# Altium project Zynq 7000 Demo.PrjPcb (part 7 of 9)

## Sheet [10] - ETHERNET.SchDoc: Z7010 B35, ADC, DAC
size B; Organization: Altium Limited; Address1: L3, 12a Rodborough Rd; Address2: Frenchs Forest; Address3: NSW; Address4: Australia 2086; DocumentNumber: 10; Revision: V1I1; SheetNumber: 10; SheetTotal: 16
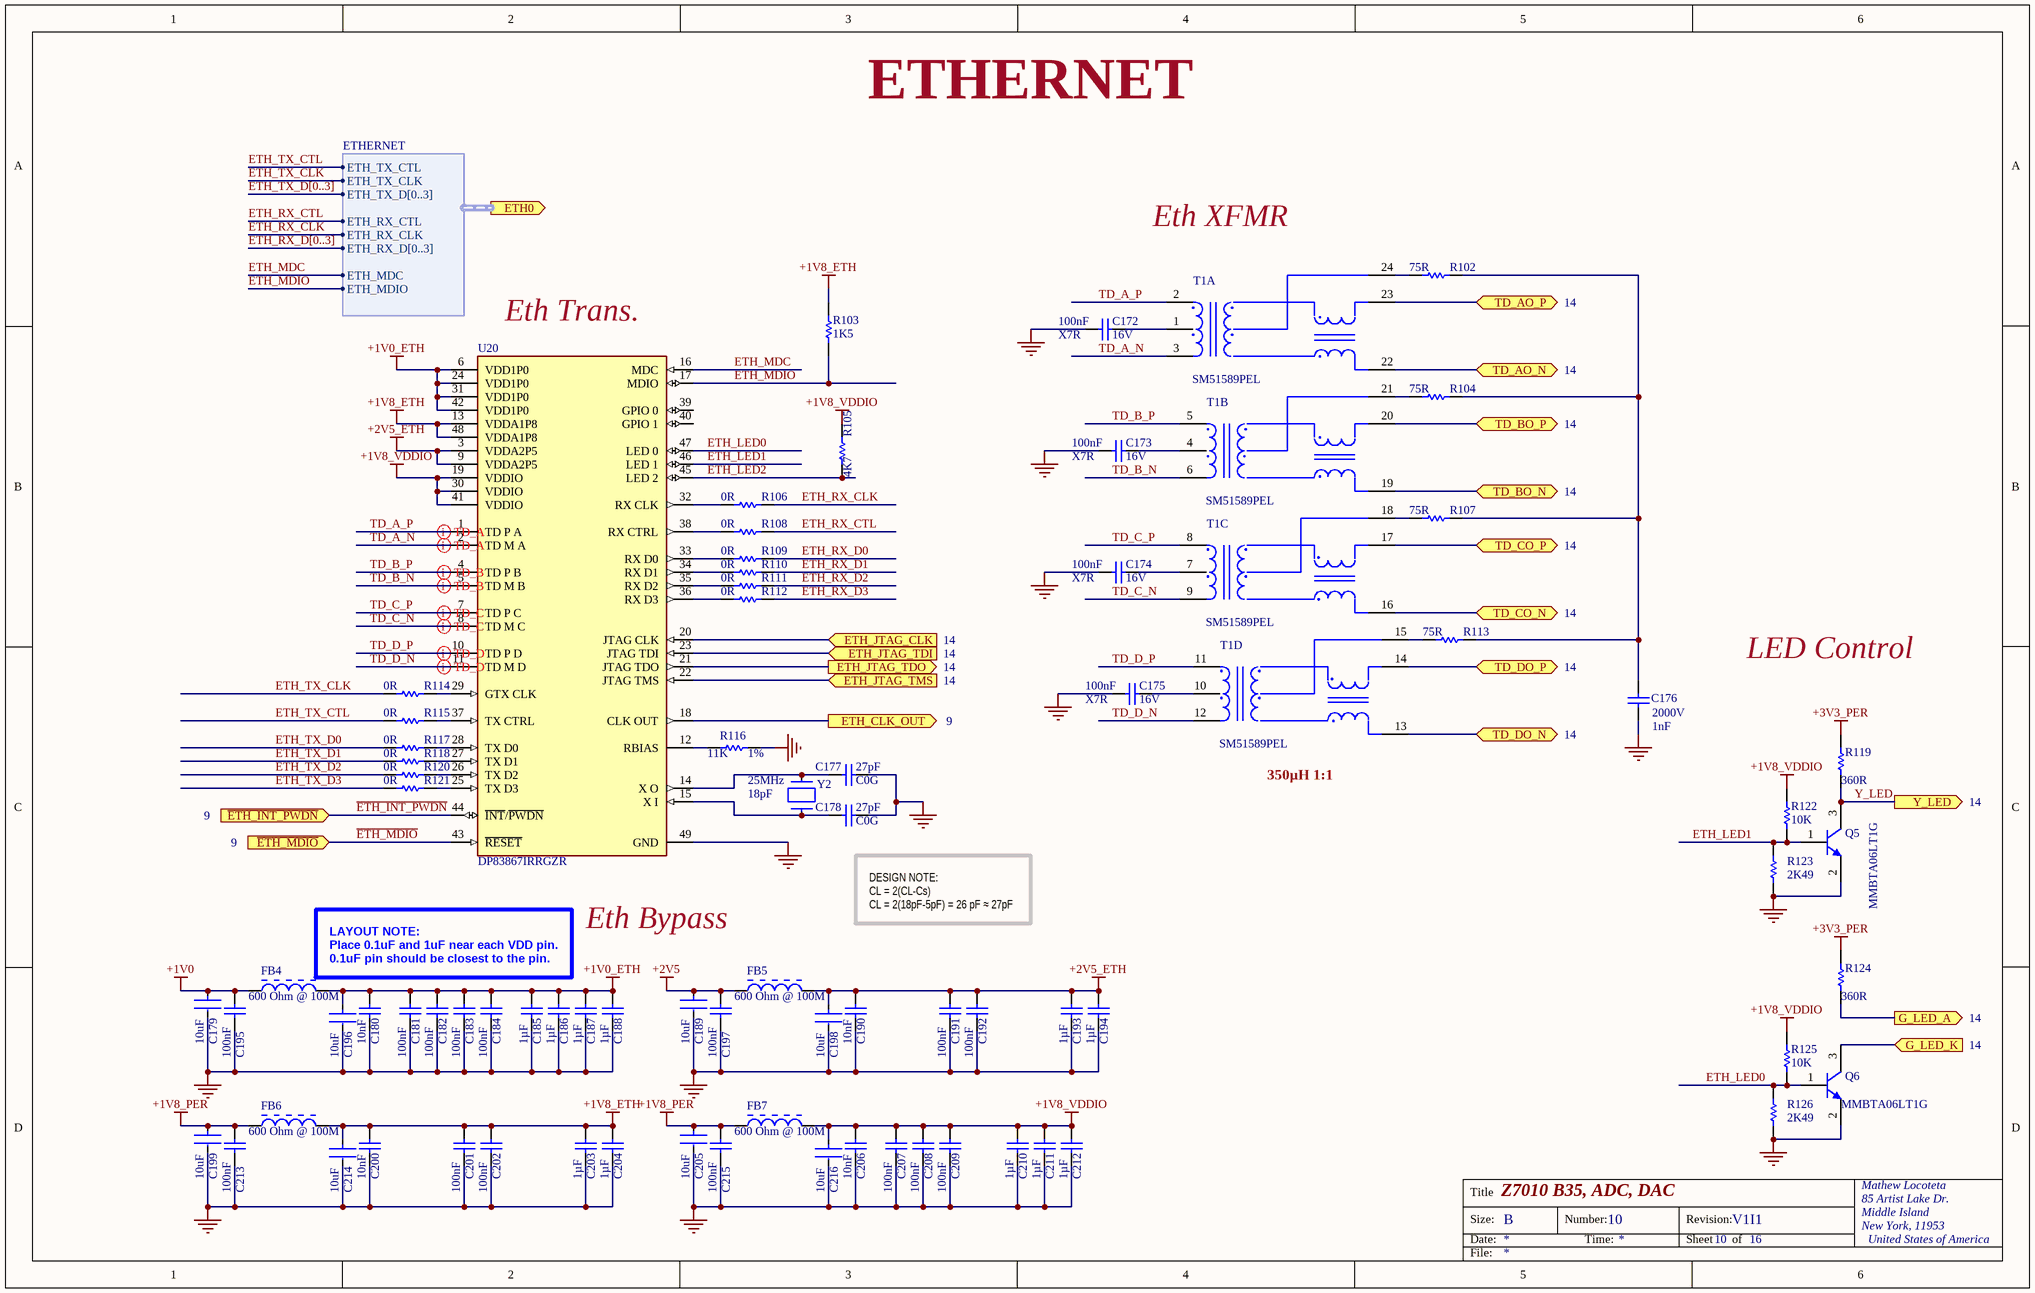
[diagram p9: [10] - ETHERNET.SchDoc]

### Parts
C172  Dielectric: X7R  Voltage Rating: 16V  Capacitance: 100nF  (hidden comment: 100nF 0402 16V)
C173  Dielectric: X7R  Voltage Rating: 16V  Capacitance: 100nF  (hidden comment: 100nF 0402 16V)
C174  Dielectric: X7R  Voltage Rating: 16V  Capacitance: 100nF  (hidden comment: 100nF 0402 16V)
C175  Dielectric: X7R  Voltage Rating: 16V  Capacitance: 100nF  (hidden comment: 100nF 0402 16V)
C176  Rated Voltage: 2000V  Capacitance: 1nF  [CAPC4620X180X75LL50T35]  (hidden comment: 1808GC102KAT1A)
C177  value 27pF  Dielecctric: C0G  [CAPC0402(1005)60_M]  (hidden comment: CAP 27pF 50V 0402(1005))
C178  value 27pF  Dielecctric: C0G  [CAPC0402(1005)60_M]  (hidden comment: CAP 27pF 50V 0402(1005))
C179  Capacitance: 10uF  [FP-CL07-IPC_C]  (hidden comment: CL05A106MP8NUB8)
C180  Capacitance: 10nF  (hidden comment: 10nF 16V 0402 X7R)
C181  Capacitance: 100nF  (hidden comment: 100nF 0402 16V)
C182  Capacitance: 100nF  (hidden comment: 100nF 0402 16V)
C183  Capacitance: 100nF  (hidden comment: 100nF 0402 16V)
C184  Capacitance: 100nF  (hidden comment: 100nF 0402 16V)
C185  value 1µF  [CAPC1005X60X30LL05T10]  (hidden comment: C0402C105K8PAC7867)
C186  value 1µF  [CAPC1005X60X30LL05T10]  (hidden comment: C0402C105K8PAC7867)
C187  value 1µF  [CAPC1005X60X30LL05T10]  (hidden comment: C0402C105K8PAC7867)
C188  value 1µF  [CAPC1005X60X30LL05T10]  (hidden comment: C0402C105K8PAC7867)
C189  Capacitance: 10uF  [FP-CL07-IPC_C]  (hidden comment: CL05A106MP8NUB8)
C190  Capacitance: 10nF  (hidden comment: 10nF 16V 0402 X7R)
C191  Capacitance: 100nF  (hidden comment: 100nF 0402 16V)
C192  Capacitance: 100nF  (hidden comment: 100nF 0402 16V)
C193  value 1µF  [CAPC1005X60X30LL05T10]  (hidden comment: C0402C105K8PAC7867)
C194  value 1µF  [CAPC1005X60X30LL05T10]  (hidden comment: C0402C105K8PAC7867)
C195  Capacitance: 100nF  (hidden comment: 100nF 0402 16V)
C196  Capacitance: 10uF  [FP-CL07-IPC_C]  (hidden comment: CL05A106MP8NUB8)
C197  Capacitance: 100nF  (hidden comment: 100nF 0402 16V)
C198  Capacitance: 10uF  [FP-CL07-IPC_C]  (hidden comment: CL05A106MP8NUB8)
C199  Capacitance: 10uF  [FP-CL07-IPC_C]  (hidden comment: CL05A106MP8NUB8)
C200  Capacitance: 10nF  (hidden comment: 10nF 16V 0402 X7R)
C201  Capacitance: 100nF  (hidden comment: 100nF 0402 16V)
C202  Capacitance: 100nF  (hidden comment: 100nF 0402 16V)
C203  value 1µF  [CAPC1005X60X30LL05T10]  (hidden comment: C0402C105K8PAC7867)
C204  value 1µF  [CAPC1005X60X30LL05T10]  (hidden comment: C0402C105K8PAC7867)
C205  Capacitance: 10uF  [FP-CL07-IPC_C]  (hidden comment: CL05A106MP8NUB8)
C206  Capacitance: 10nF  (hidden comment: 10nF 16V 0402 X7R)
C207  Capacitance: 100nF  (hidden comment: 100nF 0402 16V)
C208  Capacitance: 100nF  (hidden comment: 100nF 0402 16V)
C209  Capacitance: 100nF  (hidden comment: 100nF 0402 16V)
C210  value 1µF  [CAPC1005X60X30LL05T10]  (hidden comment: C0402C105K8PAC7867)
C211  value 1µF  [CAPC1005X60X30LL05T10]  (hidden comment: C0402C105K8PAC7867)
C212  value 1µF  [CAPC1005X60X30LL05T10]  (hidden comment: C0402C105K8PAC7867)
C213  Capacitance: 100nF  (hidden comment: 100nF 0402 16V)
C214  Capacitance: 10uF  [FP-CL07-IPC_C]  (hidden comment: CL05A106MP8NUB8)
C215  Capacitance: 100nF  (hidden comment: 100nF 0402 16V)
C216  Capacitance: 10uF  [FP-CL07-IPC_C]  (hidden comment: CL05A106MP8NUB8)
FB4  Impedance (at 100 MHz): 600 Ohm @ 100M  [MURA-BLM18-RF-H4-CHIP-2_V]  (hidden comment: BLM18HE601SN1D)
FB5  Impedance (at 100 MHz): 600 Ohm @ 100M  [MURA-BLM18-RF-H4-CHIP-2_V]  (hidden comment: BLM18HE601SN1D)
FB6  Impedance (at 100 MHz): 600 Ohm @ 100M  [MURA-BLM18-RF-H4-CHIP-2_V]  (hidden comment: BLM18HE601SN1D)
FB7  Impedance (at 100 MHz): 600 Ohm @ 100M  [MURA-BLM18-RF-H4-CHIP-2_V]  (hidden comment: BLM18HE601SN1D)
Q5  MMBTA06LT1G  [ONSC-SOT-23-3-318-08_V]
Q6  MMBTA06LT1G  [ONSC-SOT-23-3-318-08_V]
R102  Resistance: 75R  (hidden comment: 75R 0805)
R103  value 1K5  [RESC1005X40X25NL05T05]  (hidden comment: CRCW04021K50FKED)
R104  Resistance: 75R  (hidden comment: 75R 0805)
R105  Resistance: 4K7  (hidden comment: 4K7 0402 1%)
R106  value 0R  [RESC1005X40X25ML05T10]  (hidden comment: CRCW04020000Z0EDHP)
R107  Resistance: 75R  (hidden comment: 75R 0805)
R108  value 0R  [RESC1005X40X25ML05T10]  (hidden comment: CRCW04020000Z0EDHP)
R109  value 0R  [RESC1005X40X25ML05T10]  (hidden comment: CRCW04020000Z0EDHP)
R110  value 0R  [RESC1005X40X25ML05T10]  (hidden comment: CRCW04020000Z0EDHP)
R111  value 0R  [RESC1005X40X25ML05T10]  (hidden comment: CRCW04020000Z0EDHP)
R112  value 0R  [RESC1005X40X25ML05T10]  (hidden comment: CRCW04020000Z0EDHP)
R113  Resistance: 75R  (hidden comment: 75R 0805)
R114  value 0R  [RESC1005X40X25ML05T10]  (hidden comment: CRCW04020000Z0EDHP)
R115  value 0R  [RESC1005X40X25ML05T10]  (hidden comment: CRCW04020000Z0EDHP)
R116  value 11K  Tolerance: 1%  [RESC1005X40X25NL05T05]  (hidden comment: CRCW040211K0FKED)
R117  value 0R  [RESC1005X40X25ML05T10]  (hidden comment: CRCW04020000Z0EDHP)
R118  value 0R  [RESC1005X40X25ML05T10]  (hidden comment: CRCW04020000Z0EDHP)
R119  value 360R  [RESC1005X40X25NL05T05]  (hidden comment: CRCW0402360RFKED)
R120  value 0R  [RESC1005X40X25ML05T10]  (hidden comment: CRCW04020000Z0EDHP)
R121  value 0R  [RESC1005X40X25ML05T10]  (hidden comment: CRCW04020000Z0EDHP)
R122  value 10K  [RESC1005X40X25ML05T10]  (hidden comment: CRCW040210K0FKEDHP)
R123  value 2K49  [RESC1005X40X25ML05T05]  (hidden comment: CRCW04022K49FKTD)
R124  value 360R  [RESC1005X40X25NL05T05]  (hidden comment: CRCW0402360RFKED)
R125  value 10K  [RESC1005X40X25ML05T10]  (hidden comment: CRCW040210K0FKEDHP)
R126  value 2K49  [RESC1005X40X25ML05T05]  (hidden comment: CRCW04022K49FKTD)
T1  SM51589PEL  [FP-SM51589PEL-MFG]  (parts A,B,C,D of 4)
U20  DP83867IRRGZR  [FP-RGZ0048B-MFG]
Y2  Load Capacitance: 18pF  Frequency: 25MHz  [FP-7A-MFG]  (hidden comment: 7A-25.000MAAJ-T)

### Ports
ETH0 (out, harness ETHERNET), ETH_CLK_OUT (out), ETH_JTAG_CLK (in), ETH_JTAG_TDI (in), ETH_JTAG_TDO (out), ETH_JTAG_TMS (in), G_LED_A (out), G_LED_K (in), TD_AO_N (bidir), TD_AO_P (bidir), TD_BO_N (bidir), TD_BO_P (bidir), TD_CO_N (bidir), TD_CO_P (bidir), TD_DO_N (bidir), TD_DO_P (bidir), Y_LED (out), ~{ETH_INT_PWDN} (in), ~{ETH_MDIO} (in)

### Harnesses
ETHERNET: ETH_TX_D[0..3], ETH_RX_D[0..3], ETH_RX_CLK, ETH_TX_CLK, ETH_TX_CTL, ETH_RX_CTL, ETH_MDC, ETH_MDIO

### Nets
+1V0: C179.1 C195.2 FB4.1
+1V0_ETH: C180.2 C181.2 C182.2 C183.2 C184.2 C185.2 C186.2 C187.2 C188.2 C196.1 FB4.2 U20.6(VDD1P0) U20.24(VDD1P0) U20.31(VDD1P0) U20.42(VDD1P0)
+1V8_ETH: C200.2 C201.2 C202.2 C203.2 C204.2 C214.1 FB6.2 R103.2 U20.13(VDDA1P8) U20.48(VDDA1P8)
+1V8_PER: C199.1 C205.1 C213.2 C215.2 FB6.1 FB7.1
+1V8_VDDIO: C206.2 C207.2 C208.2 C209.2 C210.2 C211.2 C212.2 C216.1 FB7.2 R105.2 R122.2 R125.2 U20.19(VDDIO) U20.30(VDDIO) U20.41(VDDIO)
+2V5: C189.1 C197.2 FB5.1
+2V5_ETH: C190.2 C191.2 C192.2 C193.2 C194.2 C198.1 FB5.2 U20.3(VDDA2P5) U20.9(VDDA2P5)
+3V3_PER: R119.2 R124.2
GND: C172.2 C173.2 C174.2 C175.2 C176.1 C177.2 C178.2 C179.2 C180.1 C181.1 C182.1 C183.1 C184.1 C185.1 C186.1 C187.1 C188.1 C189.2 C190.1 C191.1 C192.1 C193.1 C194.1 C195.1 C196.2 C197.1 C198.2 C199.2 C200.1 C201.1 C202.1 C203.1 C204.1 C205.2 C206.1 C207.1 C208.1 C209.1 C210.1 C211.1 C212.1 C213.1 C214.2 C215.1 C216.2 Q5.2(E) Q6.2(E) R116.1 R123.1 R126.1 U20.49(GND)
~{ETH_INT_PWDN}: U20.44(~{INT}/~{PWDN}) ; port ~{ETH_INT_PWDN}
~{ETH_MDIO}: U20.43(~{RESET}) ; port ~{ETH_MDIO}
ETH_CLK_OUT: U20.18(CLK_OUT) ; port ETH_CLK_OUT
ETH_JTAG_CLK: U20.20(JTAG_CLK) ; port ETH_JTAG_CLK
ETH_JTAG_TDI: U20.23(JTAG_TDI) ; port ETH_JTAG_TDI
ETH_JTAG_TMS: U20.22(JTAG_TMS) ; port ETH_JTAG_TMS
ETH_LED0: Q6.1(B) R125.1 R126.2 U20.47(LED_0)
ETH_LED1: Q5.1(B) R122.1 R123.2 U20.46(LED_1)
ETH_LED2: R105.1 U20.45(LED_2)
ETH_MDC: U20.16(MDC) ; port ETH0.ETH_MDC
ETH_MDIO: R103.1 U20.17(MDIO) ; port ETH0.ETH_MDIO
ETH_RX_CLK: R106.2 ; port ETH0.ETH_RX_CLK
ETH_RX_CTL: R108.2 ; port ETH0.ETH_RX_CTL
ETH_RX_D0: R109.2
ETH_RX_D1: R110.2
ETH_RX_D2: R111.2
ETH_RX_D3: R112.2
ETH_TX_CLK: R114.1 ; port ETH0.ETH_TX_CLK
ETH_TX_CTL: R115.1 ; port ETH0.ETH_TX_CTL
ETH_TX_D0: R117.1
ETH_TX_D1: R118.1
ETH_TX_D2: R120.1
ETH_TX_D3: R121.1
G_LED_A: R124.1 ; port G_LED_A
G_LED_K: Q6.3(C) ; port G_LED_K
JTAG_TDI: U20.21(JTAG_TDO) ; port ETH_JTAG_TDO
TD_A_N: T1.3(MX1-) U20.2(TD_M_A)
TD_A_P: T1.2(MX1+) U20.1(TD_P_A)
TD_AO_N: T1.22(TD1-) ; port TD_AO_N
TD_AO_P: T1.23(TD1+) ; port TD_AO_P
TD_B_N: T1.6(MX2-) U20.5(TD_M_B)
TD_B_P: T1.5(MX2+) U20.4(TD_P_B)
TD_BO_N: T1.19(TD2-) ; port TD_BO_N
TD_BO_P: T1.20(TD2+) ; port TD_BO_P
TD_C_N: T1.9(MX3-) U20.8(TD_M_C)
TD_C_P: T1.8(MX3+) U20.7(TD_P_C)
TD_CO_N: T1.16(TD3-) ; port TD_CO_N
TD_CO_P: T1.17(TD3+) ; port TD_CO_P
TD_D_N: T1.12(MX4-) U20.11(TD_M_D)
TD_D_P: T1.11(MX4+) U20.10(TD_P_D)
TD_DO_N: T1.13(TD4-) ; port TD_DO_N
TD_DO_P: T1.14(TD4+) ; port TD_DO_P
Y_LED: Q5.3(C) R119.1 ; port Y_LED
NetC172_1: C172.1 T1.1(MCT1)
NetC173_1: C173.1 T1.4(MCT2)
NetC174_1: C174.1 T1.7(MCT3)
NetC175_1: C175.1 T1.10(MCT4)
NetC176_2: C176.2 R102.2 R104.2 R107.2 R113.2
NetC177_1: C177.1 U20.14(X_O) Y2.2
NetC178_1: C178.1 U20.15(X_I) Y2.1
NetR102_1: R102.1 T1.24(TCT1)
NetR104_1: R104.1 T1.21(TCT2)
NetR106_1: R106.1 U20.32(RX_CLK)
NetR107_1: R107.1 T1.18(TCT3)
NetR108_1: R108.1 U20.38(RX_CTRL)
NetR109_1: R109.1 U20.33(RX_D0)
NetR110_1: R110.1 U20.34(RX_D1)
NetR111_1: R111.1 U20.35(RX_D2)
NetR112_1: R112.1 U20.36(RX_D3)
NetR113_1: R113.1 T1.15(TCT4)
NetR114_2: R114.2 U20.29(GTX_CLK)
NetR115_2: R115.2 U20.37(TX_CTRL)
NetR116_2: R116.2 U20.12(RBIAS)
NetR117_2: R117.2 U20.28(TX_D0)
NetR118_2: R118.2 U20.27(TX_D1)
NetR120_2: R120.2 U20.26(TX_D2)
NetR121_2: R121.2 U20.25(TX_D3)

Not connected (* = marked no-connect by the designer): U20 39(GPIO_0) 40(GPIO_1)

### Buses and harness runs
bus ETH_RX_D[0..3]
bus ETH_TX_D[0..3]

### Layout directives
differential pair: TD_A_N, TD_A_P, TD_B_N, TD_B_P, TD_C_N, TD_C_P, TD_D_N, TD_D_P

### Notes on the sheet
- ETHERNET
- (near T1) Eth XFMR
- 14
- (near U20) Eth Trans.
- LED Control
- 9
- (near T1) 350µH 1:1
- Eth Bypass
- DESIGN NOTE:
  CL = 2(CL-Cs)
  CL = 2(18pF-5pF) = 26 pF ≈ 27pF
- LAYOUT NOTE:
  Place 0.1uF and 1uF near each VDD pin. 0.1uF pin should be closest to the pin.
- Title
- Size:
- Date:
- B
- Number:
- Time:
- Revision:
- Sheet
- of
- Mathew Locoteta
- 85 Artist Lake Dr.
- Middle Island
- New York, 11953
- United States of America
- File:

### Library data of the parts
C172-C175 C181-C184 C191 C192 C195 C197 C201 C202 C207-C209 C213 C215 = C0402C104J4RACTU: as C159-C171 on sheet [9] - Z7010 B35, ADC, DAC; Supplier 1: Digi-Key; Manufacturer: KEMET; Manufacturer Part Number: C0402C104J4RACTU; RoHS: Yes; Category: Ceramic Capacitors; Stock 1: 106350; Pricing 1: 1=0.48000, 10=0.33900, 50=0.25620, 100=0.22310, 500=0.16528, 1000=0.14049, 2500=0.13223, 5000=0.12396 (USD); Mount: Surface Mount,PCB; Case/Package: 0402; Case Code (Metric): 1005; Case Code (Imperial): 0402; Dielectric Material: Ceramic; Contact Plating: Tin,Matte; Min Operating Temperature: -55°C; Max Operating Temperature: 125°C; Tolerance: 5%; Packaging: Tape and Reel; Package Quantity: 1; Termination: SMD/SMT; Voltage: 16V; Length: 1mm; Height: 0.5mm; Width: 0.02inch; Thickness: 0.022inch; Depth: 0.5mm; Radiation Hardening: No; REACH SVHC: No SVHC; ComponentLink1URL: https://datasheet.ciiva.com/5415/kem-c1002-x7r-smd-5415819.pdf?src-supplier=Mouser; ComponentLink1Description: https://datasheet.ciiva.com/5415/kem-c1002-x7r-smd-5415819.pdf?src-supplier=Mouser; ComponentLink2URL: https://datasheet.ciiva.com/46424/1851736-46424159.pdf?src-supplier=Element14; ComponentLink2Description: https://datasheet.ciiva.com/46424/1851736-46424159.pdf?src-supplier=Element14; Supplier Part Number 1: 399-7761-1-ND; Voltage Rating (DC): 16V
  C181-C184 C191 C192 C195 C197 C201 C202 C207-C209 C213 C215: Dielectric: X7R; Voltage Rating: 16V
C176 = CMP-2000-05503-1: Chip Capacitor, 1000 pF, +/- 10%, 2000 V, -55 to 125 degC, 1808 (4520 Metric), RoHS, Tape and Reel; Manufacturer: AVX; Dielectric: X7R; Package Reference: 1808; Datasheet Version: 06/2016; Package Description: 2-Pin Surface Mount Device, Body 4.6 x 2 mm; Case Size/Dimension: 1808; Mounting Technology: SurfaceMount; Datasheet URL: http://datasheets.avx.com/AVX-HV_MLCC.pdf; Tolerance (%): ±10%; Manufacturer URL: http://www.avx.com/
C177 C178 = CMP-1034-00963-1: CAP 27pF 50V ±5% 0402 (1005 Metric) Thickness 0.6mm SMD; Case-EIA: 0402; Case-Metric: 1005; Tolerance: Â±5%; Max Thickness: 0.6 mm; Rated Voltage: 50 V; Technology: SMT
C179 C189 C196 C198 C199 C205 C214 C216 = CMP-13271-002778-1: Cap Ceramic 10uF 10V X5R ±20% SMD 0402 +85°C Paper T/R; Length: 0.039inch; Mount: Surface Mount; Case Code (Imperial): 0402; Max Operating Temperature: 85°C; Voltage Rating: 10V; Min Operating Temperature: -55°C; Case/Package: 0402; Thickness: 0.035inch; Width: 0.02inch; Case Code (Metric): 1005; Packaging: Tape and Reel; Tolerance: 20%
C180 C190 C200 C206 = C0402C103J4RACTU: KEMET - C0402C103J4RACTU - SMD Multilayer Ceramic Capacitor, 10000 pF, 16 V, 0402 [1005 Metric], ± 5%, X7R, C Series KEMET; Dissipation Factor: 3.5%; Supplier 1: Digi-Key; Manufacturer: KEMET; Manufacturer Part Number: C0402C103J4RACTU; RoHS: Yes; Category: Ceramic Capacitors; Stock 1: 814650; Pricing 1: 1=0.53000, 10=0.37100, 50=0.25960, 100=0.22250, 500=0.16688, 1000=0.14093, 2500=0.13351, 5000=0.12609 (USD); Mount: Surface Mount,PCB; Case/Package: 0402; Number of Pins: 2; Case Code (Metric): 1005; Case Code (Imperial): 0402; Dielectric Material: Ceramic; Min Operating Temperature: -55°C; Max Operating Temperature: 125°C; Packaging: Tape and Reel; Tolerance: 5%; Package Quantity: 10000; Voltage Rating (DC): 16V; Termination: SMD/SMT; Voltage: 16V; Length: 1mm; Height: 0.5mm; Width: 0.02inch; Thickness: 0.022inch; Depth: 0.5mm; Radiation Hardening: No; REACH SVHC: No SVHC; ComponentLink1URL: https://datasheet.ciiva.com/46448/1851736-46448647.pdf?src-supplier=Element14; ComponentLink1Description: https://datasheet.ciiva.com/46448/1851736-46448647.pdf?src-supplier=Element14; ComponentLink2URL: https://datasheet.ciiva.com/14593/70095383-14593069.pdf?src-supplier=Allied+Electronics; ComponentLink2Description: https://datasheet.ciiva.com/14593/70095383-14593069.pdf?src-supplier=Allied+Electronics; ComponentLink3URL: https://datasheet.ciiva.com/7747/kem-c1002-x7r-smd-7747611.pdf?src-supplier=Element14; ComponentLink3Description: https://datasheet.ciiva.com/7747/kem-c1002-x7r-smd-7747611.pdf?src-supplier=Element14; ComponentLink4URL: https://datasheet.ciiva.com/14604/70095383-14604557.pdf?src-supplier=Allied+Electronics; ComponentLink4Description: https://datasheet.ciiva.com/14604/70095383-14604557.pdf?src-supplier=Allied+Electronics; ComponentLink5URL: https://datasheet.ciiva.com/28645/1851736-28645374.pdf?src-supplier=Element14; ComponentLink5Description: https://datasheet.ciiva.com/28645/1851736-28645374.pdf?src-supplier=Element14; Supplier Part Number 1: 399-1039-1-ND; Dielectric: X7R; Voltage Rating: 16V
C185-C188 C193 C194 C203 C204 C210-C212 = CMP-2008-02081-1: Manufacturer: Kemet; Part Number: C0402C105K8PAC7867
FB4-FB7 = CMP-0686-00374-2: Chip Ferrite Bead for GHz Band High-speed Signal Lines, 600 Ohm, 800 mA, -55 to 125 degC, 1.6 x 0.8 x 0.95 mm SMD, Tape and Reel; Manufacturer: Murata; DC Resistance: 0.25 Ohm Max.; Rated Current: 800 mA; ComponentLink1URL: http://www.murata.com/; Mounting Technology: Surface Mount; ComponentLink2URL: http://www.murata.com/products/catalog/pdf/c31e.pdf; ComponentLink1Description: Manufacturer URL; PackageDescription: 2-Pin Chip, Body 1.6 x 0.8 mm; ComponentLink3Description: Package Specification; Operating Temperature Range: -55 to 125 degC; ComponentLink3URL: http://www.murata.com/products/catalog/pdf/c31e.pdf; ComponentLink2Description: Datasheet; DatasheetVersion: 08/2013; PartNumber: BLM18HE601SN1D; Packing: Tape and Reel; PackageReference: BLM18_H950-2
Q5 Q6 = CMP-1048-00619-1: Driver Transistor, NPN Silicon, 3-Pin SOT-23, Pb-Free, Tape and Reel; Manufacturer: On Semiconductor; IC Continuous (A): 0.5; fT Min (MHz): 100; ComponentLink1URL: http://www.onsemi.com/; ComponentLink1Description: Manufacturer URL; ComponentLink2Description: Datasheet; ComponentLink3URL: http://www.onsemi.cn/pub_link/Collateral/318-08.PDF; Packing: Tape and Reel; PackageVersion: Rev. AP, 11/2009; PackageDescription: 3-Pin Small Outline Transistor, Body 2.92 x 1.3 mm, Pitch 0.95 mm; RoHS: TRUE; PartNumber: MMBTA06LT1G; ComponentLink2URL: http://www.onsemi.cn/pub_link/Collateral/MMBTA05LT1-D.PDF; DatasheetVersion: Rev. 8; PackageReference: SOT-23-3-318-08; Polarity: NPN; ComponentLink3Description: Package Specification; Mounting Technology: Surface Mount
R102 R104 R107 R113 = CRCW080575R0FKEA: VISHAY - CRCW080575R0FKEA - Chipwiderstand, Oberflächenmontage, Dickschicht, 0805 [Metrisch 2012], 75 ohm, Baureihe CRCW, 150 V; Tolerance: 1%; Temperature Coefficient: 100ppm/°C; Power Rating: 125mW; Voltage Rating: 150V; Supplier 1: Digi-Key; Manufacturer: Vishay; Manufacturer Part Number: CRCW080575R0FKEA; RoHS: Yes; Category: Chip SMD Resistors; Stock 1: 74647; Pricing 1: 1=0.10000, 10=0.05700, 100=0.02310, 1000=0.01039, 2500=0.00902 (USD); Case/Package: 0805; Contact Plating: Tin; Case Code (Metric): 2012; Weight: 0.000194oz; Min Operating Temperature: -55°C; Max Operating Temperature: 155°C; Resistor Type: Thick Film; Packaging: Tape and Reel; Package Quantity: 10; Number of Terminations: 2; Max Power Dissipation: 125mW; Features: Automotive AEC-Q200; Termination: SMD/SMT; Voltage Rating (DC): 150V; Length: 2mm; Width: 0.049inch; Height: 0.45mm; Depth: 1.25mm; Lead Free: Lead Free; Military Standard: Not; REACH SVHC: Unknown; ComponentLink1URL: https://datasheet.ciiva.com/11811/0900766b80d98b26-11811307.pdf?src-supplier=RSComponents; ComponentLink1Description: https://datasheet.ciiva.com/11811/0900766b80d98b26-11811307.pdf?src-supplier=RSComponents; ComponentLink2URL: https://datasheet.ciiva.com/2495/dcrcwe3-2495665.pdf?src-supplier=Digi-Key; ComponentLink2Description: https://datasheet.ciiva.com/2495/dcrcwe3-2495665.pdf?src-supplier=Digi-Key; ComponentLink3URL: https://datasheet.ciiva.com/7673/1697337-7673495.pdf?src-supplier=Element14; ComponentLink3Description: https://datasheet.ciiva.com/7673/1697337-7673495.pdf?src-supplier=Element14; ComponentLink4URL: https://datasheet.ciiva.com/26316/fld-crcw-e3-data-en-26316535.pdf?src-supplier=Distrelec; ComponentLink4Description: https://datasheet.ciiva.com/26316/fld-crcw-e3-data-en-26316535.pdf?src-supplier=Distrelec; ComponentLink5URL: https://datasheet.ciiva.com/2495/dcrcwe3-2495666.pdf?src-supplier=Digi-Key; ComponentLink5Description: https://datasheet.ciiva.com/2495/dcrcwe3-2495666.pdf?src-supplier=Digi-Key; ComponentLink6URL: https://datasheet.ciiva.com/7673/1697337-7673369.pdf?src-supplier=Element14; ComponentLink6Description: https://datasheet.ciiva.com/7673/1697337-7673369.pdf?src-supplier=Element14; ComponentLink7URL: https://datasheet.ciiva.com/16763/70201119-16763292.pdf?src-supplier=Allied+Electronics; ComponentLink7Description: https://datasheet.ciiva.com/16763/70201119-16763292.pdf?src-supplier=Allied+Electronics; ComponentLink8URL: https://datasheet.ciiva.com/5542/dcrcwe3-109170-5542910.pdf?src-supplier=Mouser; ComponentLink8Description: https://datasheet.ciiva.com/5542/dcrcwe3-109170-5542910.pdf?src-supplier=Mouser; ComponentLink9URL: https://datasheet.ciiva.com/2495/dcrcwe3-2495667.pdf?src-supplier=Digi-Key; ComponentLink9Description: https://datasheet.ciiva.com/2495/dcrcwe3-2495667.pdf?src-supplier=Digi-Key; Supplier Part Number 1: 541-75.0CCT-ND; Case Code (Imperial): 0805
R103 = CMP-2002-08297-1: Manufacturer: Vishay Dale; Part Number: CRCW04021K50FKED
R105 = CRCW04024K70FKED: Resistor SMD 4.7 kOhm 0402 PU=10000 ST, CRCW04024K70FKED, Vishay; Power Rating: 63mW; Temperature Coefficient: 100ppm/°C; Voltage Rating: 50V; Supplier 1: Digi-Key; Manufacturer: Vishay; Manufacturer Part Number: CRCW04024K70FKED; RoHS: Yes; Category: Chip SMD Resistors; Stock 1: 575743; Pricing 1: 1=0.10000, 10=0.03500, 100=0.01410, 1000=0.00633, 2500=0.00550, 5000=0.00454 (USD); Mount: Surface Mount; Case/Package: 0402; Weight: 2.3E-05oz; Contact Plating: Tin; Case Code (Imperial): 0402; Case Code (Metric): 1005; Min Operating Temperature: -55°C; Max Operating Temperature: 155°C; Tolerance: 1%; Composition: Thick Film; Packaging: Tape and Reel; Package Quantity: 10; Termination: SMD/SMT; Military Standard: Not; Voltage Rating (DC): 50V; Number of Terminations: 2; Max Power Dissipation: 63mW; Features: Automotive AEC-Q200; Length: 1mm; Height: 0.35mm; Width: 0.5mm; Depth: 0.5mm; Radiation Hardening: No; Lead Free: Lead Free; REACH SVHC: Unknown; ComponentLink1URL: https://datasheet.ciiva.com/11808/0900766b80d98824-11808622.pdf?src-supplier=RSComponents; ComponentLink1Description: https://datasheet.ciiva.com/11808/0900766b80d98824-11808622.pdf?src-supplier=RSComponents; ComponentLink2URL: https://datasheet.ciiva.com/3256/dcrcwe3-3256597.pdf?src-supplier=Avnet; ComponentLink2Description: https://datasheet.ciiva.com/3256/dcrcwe3-3256597.pdf?src-supplier=Avnet; ComponentLink3URL: https://datasheet.ciiva.com/5550/dcrcwe3-109170-5550295.pdf?src-supplier=Mouser; ComponentLink3Description: https://datasheet.ciiva.com/5550/dcrcwe3-109170-5550295.pdf?src-supplier=Mouser; ComponentLink4URL: https://datasheet.ciiva.com/16764/70201119-16764281.pdf?src-supplier=Allied+Electronics; ComponentLink4Description: https://datasheet.ciiva.com/16764/70201119-16764281.pdf?src-supplier=Allied+Electronics; ComponentLink5URL: https://datasheet.ciiva.com/2463/dcrcwe3-2463034.pdf?src-supplier=Digi-Key; ComponentLink5Description: https://datasheet.ciiva.com/2463/dcrcwe3-2463034.pdf?src-supplier=Digi-Key; ComponentLink6URL: https://datasheet.ciiva.com/16881/dcrcwe3-16881690.pdf?src-supplier=Avnet+Europe; ComponentLink6Description: https://datasheet.ciiva.com/16881/dcrcwe3-16881690.pdf?src-supplier=Avnet+Europe; ComponentLink7URL: https://datasheet.ciiva.com/2463/dcrcwe3-2463035.pdf?src-supplier=Digi-Key; ComponentLink7Description: https://datasheet.ciiva.com/2463/dcrcwe3-2463035.pdf?src-supplier=Digi-Key; ComponentLink8URL: https://datasheet.ciiva.com/8079/1697337-8079643.pdf?src-supplier=Element14; ComponentLink8Description: https://datasheet.ciiva.com/8079/1697337-8079643.pdf?src-supplier=Element14; ComponentLink9URL: https://datasheet.ciiva.com/2463/dcrcwe3-2463036.pdf?src-supplier=Digi-Key; ComponentLink9Description: https://datasheet.ciiva.com/2463/dcrcwe3-2463036.pdf?src-supplier=Digi-Key; ComponentLink10URL: https://datasheet.ciiva.com/26316/fld-crcw-e3-data-en-26316654.pdf?src-supplier=Distrelec; ComponentLink10Description: https://datasheet.ciiva.com/26316/fld-crcw-e3-data-en-26316654.pdf?src-supplier=Distrelec; Supplier Part Number 1: 541-4.70KLCT-ND
R106 R108-R112 R114 R115 R117 R118 R120 R121 = CMP-2002-03041-1: Manufacturer: Vishay Dale; Part Number: CRCW04020000Z0EDHP
R116 = CMP-2002-08157-1: Manufacturer: Vishay Dale; Part Number: CRCW040211K0FKED
R119 R124 = CMP-2002-08546-1: Manufacturer: Vishay Dale; Part Number: CRCW0402360RFKED
R122 R125 = CMP-2002-03043-1: Manufacturer: Vishay Dale; Part Number: CRCW040210K0FKEDHP
R123 R126 = CMP-2002-00377-1: Manufacturer: Vishay Dale; Part Number: CRCW04022K49FKTD
T1 = CMP-07264-000003-1: PULSE XFMR 1CT:1CT 350UH; Manufacturer: Bourns; Return Loss: -10dB; Insertion Loss: -1dB; Isolation Voltage: 5000V; Capacitance: 35pF; Value: 35pF; Turns Ratio: 1:1; Standoff Height: 0.25mm; Lead Free: Yes; Category: Trans; Temperature: -40°C to +85°C; ComponentLink2URL: https://www.bourns.com/docs/product-datasheets/sm51589pel.pdf?sfvrsn=24b697f1_27; Device Class L2: Transformers; RoHS: TRUE; Device Class L3: unset; Automotive: No; ComponentLink2Description: Datasheet; Manufacturer Part Number: SM51589PEL; Temperature Range High: +85°C; Package: SM51589PEL; Mouser Description: Telecom Transformer 1CT: 1CT 24Term. Gull Wing SMD; Height: 6mm; Digikey Description: PULSE XFMR 1CT:1CT 350UH; Temperature Range Low: -40°C; Device Class L1: Passive Components; Inductance Primary: 350uH; Octopart: https://octopart.com/sm51589pel-bourns-49272966
U20 = CMP-04874-000001-1: IC ETHERNET PHY 48VQFN; Manufacturer: Texas Instruments; Min Supply Voltage: 0.95V; Max Junction Temp: +105°C; Simplex Duplex: Full Duplex; Nominal Supply Current: 24-137mA; Standoff Height: 0mm; Data Rate: 1000Mbits/s; Max Supply Voltage: 3.45V; Octopart: https://octopart.com/dp83867irrgzr-texas+instruments-61842583; Digikey Description: IC ETHERNET PHY 48VQFN; Category: IC; Device Class L3: Ethernet Interface ICs; ComponentLink2Description: Datasheet; RoHS: TRUE; Temperature: -40°C to +85°C; Device Class L2: Interface ICs; Package: RGZ0048B; Temperature Range High: +85°C; ComponentLink2URL: http://www.ti.com/lit/ds/symlink/dp83867ir.pdf; Device Class L1: Integrated Circuits (ICs); Lead Free: Yes; Manufacturer Part Number: DP83867IRRGZR; Mouser Description: Ethernet ICs 10/100/1000 ENET PHY; Automotive: No; Temperature Range Low: -40°C; Height: 1mm; Interface: Ethernet
Y2 = CMP-18717-000008-1: CRYSTAL 25.0000MHZ 18PF SMD; Frequency Tolerance: 30ppm; ESR (Equivalent Series Resistance): 50R; Width: 0.126inch; REACH SVHC: No SVHC; Max Operating Temperature: 70°C; Case/Package: SMD/SMT; Length: 5mm; Height: 0.053inch; Number of Pins: 2; Packaging: Tape and Reel; Termination: SMD/SMT; Mount: Surface Mount; Depth: 3.2mm; Tolerance: 30ppm; Min Operating Temperature: -40°C; Package Quantity: 1000; Lead Free: Lead Free; Frequency Stability: 30ppm

## Sheet [11] - PROTECTED IO.SchDoc: PROTECTED IO
size B; Organization: Altium Limited; Address1: L3, 12a Rodborough Rd; Address2: Frenchs Forest; Address3: NSW; Address4: Australia 2086; DocumentNumber: 11; Revision: V1I1; SheetNumber: 11; SheetTotal: 16
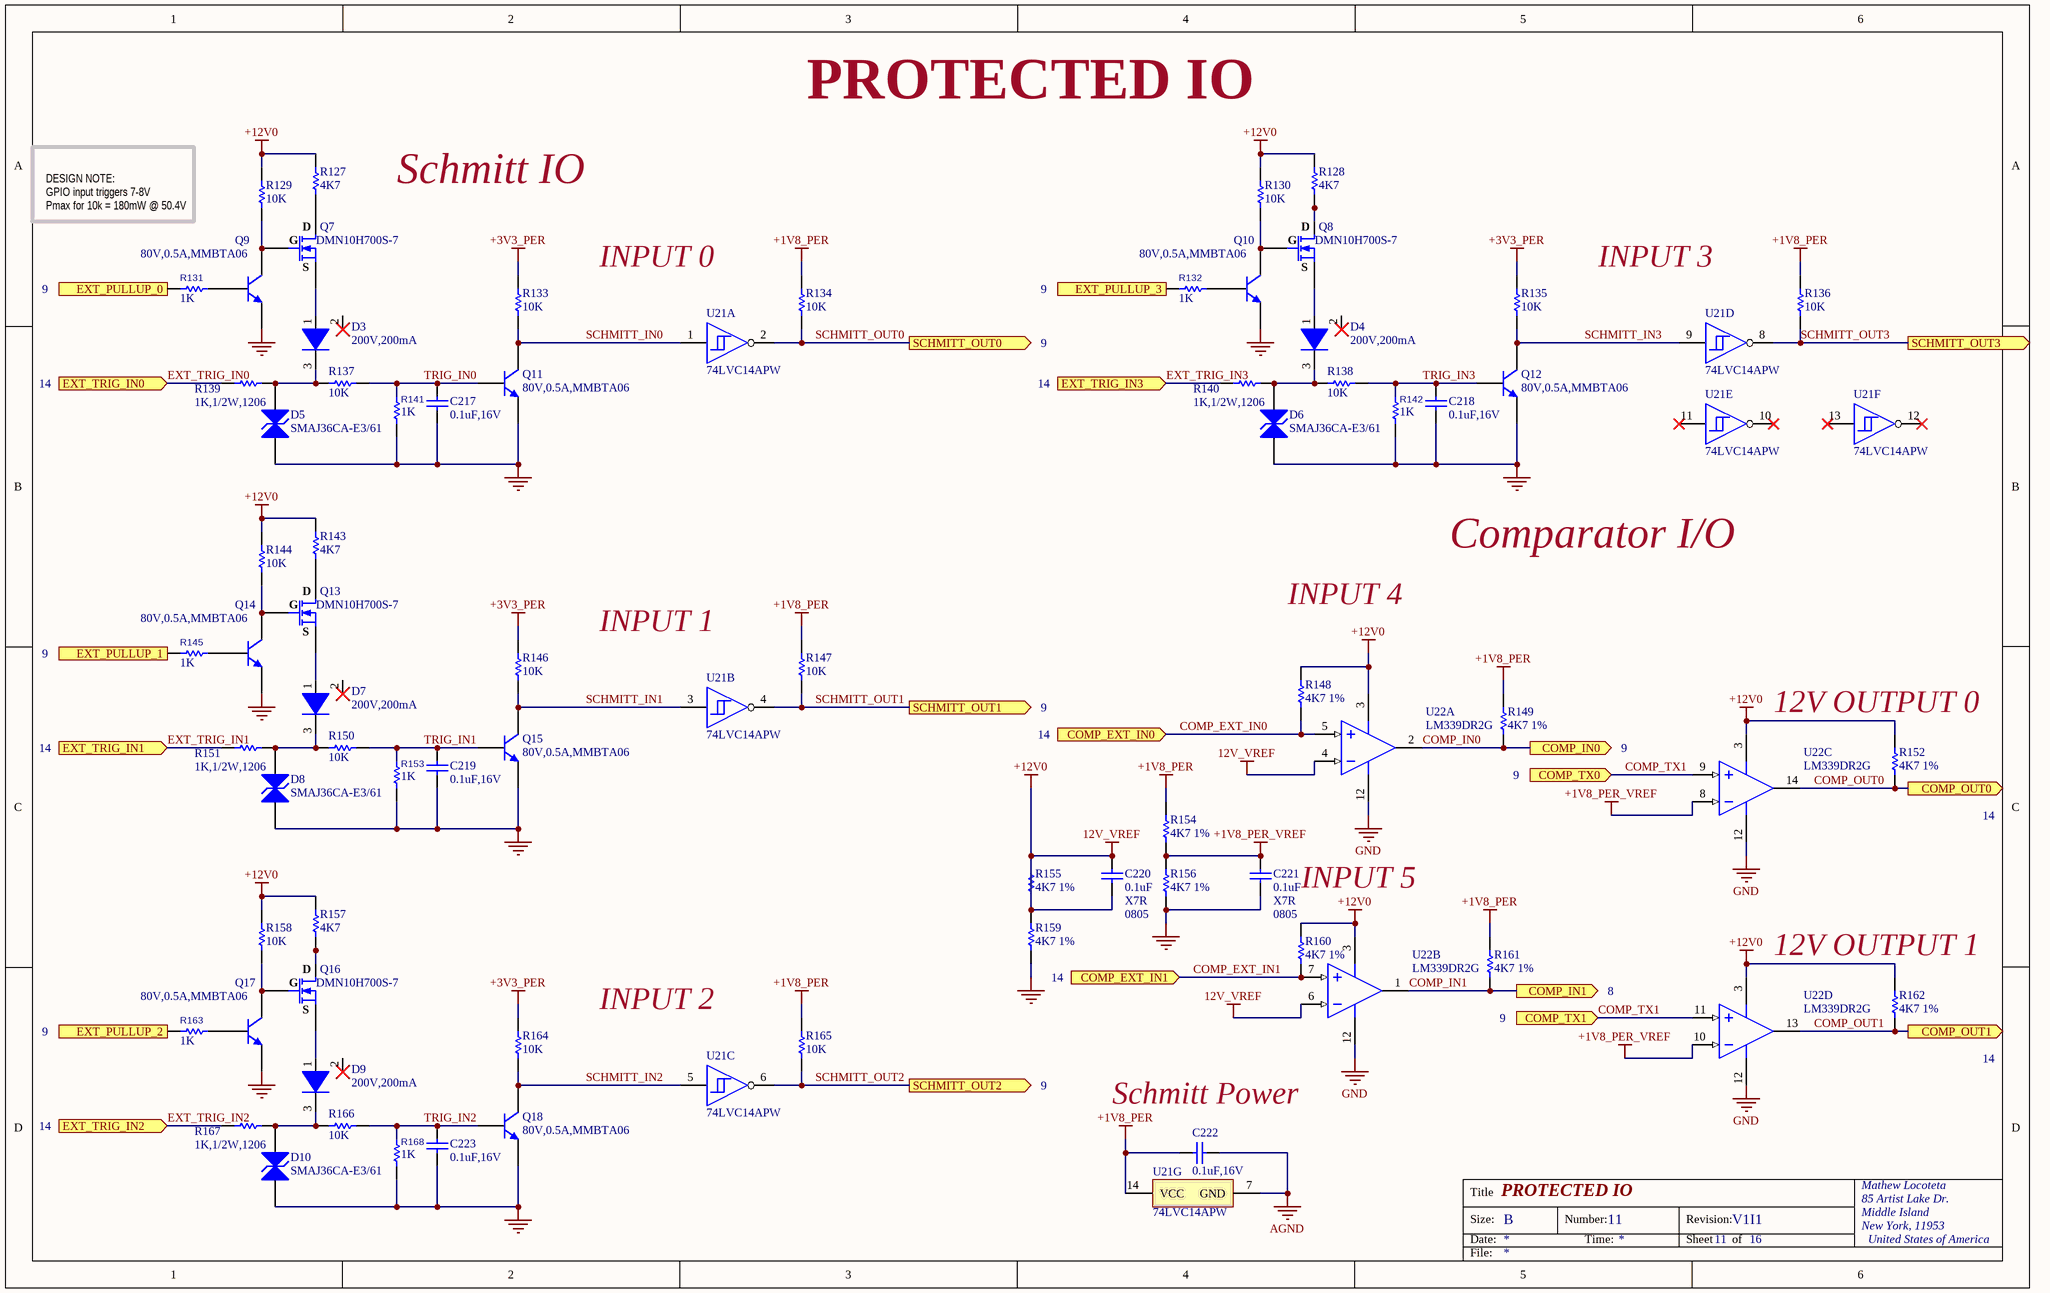
[diagram p10: [11] - PROTECTED IO.SchDoc]

### Parts
C217  0.1uF,16V  [C0402]
C218  0.1uF,16V  [C0402]
C219  0.1uF,16V  [C0402]
C220  0.1uF  Dielectric: X7R  Case Code (Imperial): 0805  [C0805]
C221  0.1uF  Dielectric: X7R  Case Code (Imperial): 0805  [C0805]
C222  0.1uF,16V  [C0402]
C223  0.1uF,16V  [C0402]
D3  200V,200mA  [SOT95P240X115-3N]
D4  200V,200mA  [SOT95P240X115-3N]
D5  SMAJ36CA-E3/61  [VISH-DO-214AC-2_L]
D6  SMAJ36CA-E3/61  [VISH-DO-214AC-2_L]
D7  200V,200mA  [SOT95P240X115-3N]
D8  SMAJ36CA-E3/61  [VISH-DO-214AC-2_L]
D9  200V,200mA  [SOT95P240X115-3N]
D10  SMAJ36CA-E3/61  [VISH-DO-214AC-2_L]
Q7  DMN10H700S-7  [SOT90P240X110-3N]
Q8  DMN10H700S-7  [SOT90P240X110-3N]
Q9  80V,0.5A,MMBTA06  [ONSC-SOT-23-3-318-08_V]
Q10  80V,0.5A,MMBTA06  [ONSC-SOT-23-3-318-08_V]
Q11  80V,0.5A,MMBTA06  [ONSC-SOT-23-3-318-08_V]
Q12  80V,0.5A,MMBTA06  [ONSC-SOT-23-3-318-08_V]
Q13  DMN10H700S-7  [SOT90P240X110-3N]
Q14  80V,0.5A,MMBTA06  [ONSC-SOT-23-3-318-08_V]
Q15  80V,0.5A,MMBTA06  [ONSC-SOT-23-3-318-08_V]
Q16  DMN10H700S-7  [SOT90P240X110-3N]
Q17  80V,0.5A,MMBTA06  [ONSC-SOT-23-3-318-08_V]
Q18  80V,0.5A,MMBTA06  [ONSC-SOT-23-3-318-08_V]
R127  4K7  [R0402]
R128  4K7  [R0402]
R129  10K  [R0603]
R130  10K  [R0603]
R131  1K  [R0402]
R132  1K  [R0402]
R133  10K  [R0603]
R134  10K  [R0603]
R135  10K  [R0603]
R136  10K  [R0603]
R137  10K  [R0603]
R138  10K  [R0603]
R139  1K,1/2W,1206  [R1206]
R140  1K,1/2W,1206  [R1206]
R141  1K  [R0402]
R142  1K  [R0402]
R143  4K7  [R0402]
R144  10K  [R0603]
R145  1K  [R0402]
R146  10K  [R0603]
R147  10K  [R0603]
R148  4K7 1%  [RESC0603(1608)_N]
R149  4K7 1%  [RESC0603(1608)_N]
R150  10K  [R0603]
R151  1K,1/2W,1206  [R1206]
R152  4K7 1%  [RESC0603(1608)_N]
R153  1K  [R0402]
R154  4K7 1%  [RESC0603(1608)_N]
R155  4K7 1%  [RESC0603(1608)_N]
R156  4K7 1%  [RESC0603(1608)_N]
R157  4K7  [R0402]
R158  10K  [R0603]
R159  4K7 1%  [RESC0603(1608)_N]
R160  4K7 1%  [RESC0603(1608)_N]
R161  4K7 1%  [RESC0603(1608)_N]
R162  4K7 1%  [RESC0603(1608)_N]
R163  1K  [R0402]
R164  10K  [R0603]
R165  10K  [R0603]
R166  10K  [R0603]
R167  1K,1/2W,1206  [R1206]
R168  1K  [R0402]
U21  74LVC14APW  [TSOP65P640X110-14N]  (parts A,B,C,D,E,F,G of 7)
U22  LM339DR2G  [ONSC-SOIC-14-751A-03_V]  (parts A,B,C,D of 4)

### Ports
COMP_EXT_IN0 (in), COMP_EXT_IN1 (in), COMP_IN0 (out), COMP_IN1 (out), COMP_OUT0 (out), COMP_OUT1 (out), COMP_TX0 (in), COMP_TX1 (in), EXT_PULLUP_0 (in), EXT_PULLUP_1 (in), EXT_PULLUP_2 (in), EXT_PULLUP_3 (in), EXT_TRIG_IN0 (in), EXT_TRIG_IN1 (in), EXT_TRIG_IN2 (in), EXT_TRIG_IN3 (in), SCHMITT_OUT0 (out), SCHMITT_OUT1 (out), SCHMITT_OUT2 (out), SCHMITT_OUT3 (out)

### Nets
+1V8_PER: C222.1 R134.2 R136.2 R147.2 R149.2 R154.2 R161.2 R165.2 U21.14(VCC)
+1V8_PER_VREF: C221.2 R154.1 R156.2 U22.8(IN3-) U22.10(IN4-)
+3V3_PER: R133.2 R135.2 R146.2 R164.2
+12V0: C220.1 C220.2 R127.2 R128.2 R129.1 R130.1 R143.2 R144.1 R148.2 R152.2 R155.1 R155.2 R157.2 R158.1 R159.2 R160.2 R162.2 U22.3(VCC) U22.4(IN1-) U22.6(IN2-)  [also labelled 12V_VREF]
AGND: C222.2 U21.7(GND)
GND: C217.2 C218.2 C219.2 C221.1 C223.2 D5.1(A1) D6.1(A1) D8.1(A1) D10.1(A1) Q9.2(E) Q10.2(E) Q11.2(E) Q12.2(E) Q14.2(E) Q15.2(E) Q17.2(E) Q18.2(E) R141.1 R142.1 R153.1 R156.1 R159.1 R168.1 U22.12(GND)
COMP_EXT_IN0: R148.1 U22.5(IN1+) ; port COMP_EXT_IN0
COMP_EXT_IN1: R160.1 U22.7(IN2+) ; port COMP_EXT_IN1
COMP_IN0: R149.1 U22.2(OUT1) ; port COMP_IN0
COMP_IN1: R161.1 U22.1(OUT2) ; port COMP_IN1
COMP_OUT0: R152.1 U22.14(OUT3) ; port COMP_OUT0
COMP_OUT1: R162.1 U22.13(OUT4) ; port COMP_OUT1
COMP_TX1: U22.9(IN3+) U22.11(IN4+) ; port COMP_TX0, port COMP_TX1
EXT_PULLUP_0: R131.2 ; port EXT_PULLUP_0
EXT_PULLUP_1: R145.2 ; port EXT_PULLUP_1
EXT_PULLUP_2: R163.2 ; port EXT_PULLUP_2
EXT_PULLUP_3: R132.2 ; port EXT_PULLUP_3
EXT_TRIG_IN0: R139.1 ; port EXT_TRIG_IN0
EXT_TRIG_IN1: R151.1 ; port EXT_TRIG_IN1
EXT_TRIG_IN2: R167.1 ; port EXT_TRIG_IN2
EXT_TRIG_IN3: R140.1 ; port EXT_TRIG_IN3
SCHMITT_IN0: Q11.3(C) R133.1 U21.1(1A)
SCHMITT_IN1: Q15.3(C) R146.1 U21.3(2A)
SCHMITT_IN2: Q18.3(C) R164.1 U21.5(3A)
SCHMITT_IN3: Q12.3(C) R135.1 U21.9(4A)
SCHMITT_OUT0: R134.1 U21.2(~{1Y}) ; port SCHMITT_OUT0
SCHMITT_OUT1: R147.1 U21.4(~{2Y}) ; port SCHMITT_OUT1
SCHMITT_OUT2: R165.1 U21.6(~{3Y}) ; port SCHMITT_OUT2
SCHMITT_OUT3: R136.1 U21.8(~{4Y}) ; port SCHMITT_OUT3
TRIG_IN0: C217.1 Q11.1(B) R137.2 R141.2
TRIG_IN1: C219.1 Q15.1(B) R150.2 R153.2
TRIG_IN2: C223.1 Q18.1(B) R166.2 R168.2
TRIG_IN3: C218.1 Q12.1(B) R138.2 R142.2
NetD3_1: D3.1(A) Q7.2(S)
NetD3_3: D3.3(K) D5.2(A2) R137.1 R139.2
NetD4_1: D4.1(A) Q8.2(S)
NetD4_3: D4.3(K) D6.2(A2) R138.1 R140.2
NetD7_1: D7.1(A) Q13.2(S)
NetD7_3: D7.3(K) D8.2(A2) R150.1 R151.2
NetD9_1: D9.1(A) Q16.2(S)
NetD9_3: D9.3(K) D10.2(A2) R166.1 R167.2
NetQ7_1: Q7.1(G) Q9.3(C) R129.2
NetQ7_3: Q7.3(D) R127.1
NetQ8_1: Q8.1(G) Q10.3(C) R130.2
NetQ8_3: Q8.3(D) R128.1
NetQ9_1: Q9.1(B) R131.1
NetQ10_1: Q10.1(B) R132.1
NetQ13_1: Q13.1(G) Q14.3(C) R144.2
NetQ13_3: Q13.3(D) R143.1
NetQ14_1: Q14.1(B) R145.1
NetQ16_1: Q16.1(G) Q17.3(C) R158.2
NetQ16_3: Q16.3(D) R157.1
NetQ17_1: Q17.1(B) R163.1

Not connected (* = marked no-connect by the designer): D3 2(A); D4 2(A); D7 2(A); D9 2(A); U21 10(~{5Y})* 11(5A)* 12(~{6Y})* 13(6A)*

### Notes on the sheet
- PROTECTED IO
- DESIGN NOTE:
  GPIO input triggers 7-8V
  Pmax for 10k = 180mW @ 50.4V
- Schmitt IO
- 9
- INPUT 0
- INPUT 3
- 14
- Comparator I/O
- INPUT 1
- INPUT 4
- (near R149) 9
- 12V OUTPUT 0
- INPUT 5
- (near R159) 14
- 12V OUTPUT 1
- INPUT 2
- (near R161) 9
- 8
- Schmitt Power
- Title
- Size:
- Date:
- B
- Number:
- Time:
- Revision:
- Sheet
- of
- Mathew Locoteta
- 85 Artist Lake Dr.
- Middle Island
- New York, 11953
- United States of America
- File:

### Library data of the parts
C217-C219 C222 C223 = CL05B104KO5VPNC: CAP CER 0.1UF 16V X7R 0402; Manufacturer: Samsung; Capacitance: 100nF; Tolerance: 10%; Supplier 1: Digi-Key; Manufacturer Part Number: CL05B104KO5VPNC; Stock 1: 940680; Pricing 1: 1=0.10000, 10=0.02600, 100=0.01140, 500=0.00812, 1000=0.00638, 2500=0.00580, 5000=0.00534 (USD); RoHS: Yes; Mount: Surface Mount; Case/Package: 0402; Case Code (Metric): 1005; Case Code (Imperial): 0402; Min Operating Temperature: -55°C; Max Operating Temperature: 125°C; Packaging: Cut Tape; Voltage Rating: 16V; Features: Soft Termination; Length: 0.039inch; Width: 0.02inch; Thickness: 0.022inch; Ratings: AEC-Q200; Lead Free: Lead Free; ComponentLink1URL: http://components.arrow.com/part/dataview/0323_06933256?src-supplier=Arrow+Europe; ComponentLink1Description: http://components.arrow.com/part/dataview/0323_06933256?src-supplier=Arrow+Europe; ComponentLink2URL: http://www.samsungsem.com/kr/support/library/product-catalog/mlcc.jsp?src-supplier=Digi-Key; ComponentLink2Description: http://www.samsungsem.com/kr/support/library/product-catalog/mlcc.jsp?src-supplier=Digi-Key; ComponentLink3URL: http://www.farnell.com/datasheets/2710692.pdf?src-supplier=Newark; ComponentLink3Description: http://www.farnell.com/datasheets/2710692.pdf?src-supplier=Newark; ComponentLink4URL: http://www.samsungsem.com/kr/support/product-search/mlcc/CL05B104KO5VPNC.jsp?src-supplier=Digi-Key; ComponentLink4Description: http://www.samsungsem.com/kr/support/product-search/mlcc/CL05B104KO5VPNC.jsp?src-supplier=Digi-Key; ComponentLink5URL: http://www.samsungsem.com/servlet/FileDownload?type=spec&file=CL05B104KO5VPNC.pdf&src-supplier=Avnet; ComponentLink5Description: http://www.samsungsem.com/servlet/FileDownload?type=spec&file=CL05B104KO5VPNC.pdf&src-supplier=Avnet; Supplier Part Number 1: 1276-6844-1-ND
C220 C221 = CL21B104KCFWPNE: CAP CER 0.1UF 100V X7R 0805; Manufacturer: Samsung; Capacitance: 100nF; Tolerance: 10%; Supplier 1: Digi-Key; Manufacturer Part Number: CL21B104KCFWPNE; Stock 1: 283289; Pricing 1: 1=0.16000, 10=0.11200, 100=0.05250, 500=0.03684, 1000=0.03050 (USD); RoHS: Yes; Mount: Surface Mount; Case/Package: 0805; Case Code (Metric): 2012; Min Operating Temperature: -55°C; Max Operating Temperature: 125°C; Packaging: Tape and Reel; Features: Soft Termination; Length: 0.079inch; Width: 0.049inch; Thickness: 0.053inch; Ratings: AEC-Q200; ComponentLink1URL: http://www.samsungsem.com/servlet/FileDownload?type=spec&file=CL21B104KCFWPNE.pdf&src-supplier=Avnet; ComponentLink1Description: http://www.samsungsem.com/servlet/FileDownload?type=spec&file=CL21B104KCFWPNE.pdf&src-supplier=Avnet; ComponentLink2URL: http://www.samsungsem.com/kr/support/product-search/mlcc/CL21B104KCFWPNE.jsp?src-supplier=Digi-Key; ComponentLink2Description: http://www.samsungsem.com/kr/support/product-search/mlcc/CL21B104KCFWPNE.jsp?src-supplier=Digi-Key; Supplier Part Number 1: 1276-6733-1-ND; Voltage Rating: 100V
D3 D4 D7 D9 = BAS21HMFHT116: DIODE GEN PURP 200V 200MA SSD3; Manufacturer: Rohm; Reverse Recovery Time: 50ns; Supplier 1: Mouser; Manufacturer Part Number: BAS21HMFHT116; Stock 1: 35226; Pricing 1: 1=0.13000, 10=0.12000, 50=0.12000, 100=0.04000, 1000=0.02700, 10000=0.02700 (USD); RoHS: No; Mount: Surface Mount; Case/Package: TO-236-3; Packaging: Cut Tape; Max Reverse Voltage (DC): 200V; Average Rectified Current: 200mA; ComponentLink1URL: https://www.rohm.com/datasheet/BAS21HMFH/bas21hmfht116-e?src-supplier=Digi-Key; ComponentLink1Description: https://www.rohm.com/datasheet/BAS21HMFH/bas21hmfht116-e?src-supplier=Digi-Key; Supplier Part Number 1: 755-BAS21HMFHT116
D5 D6 D8 D10 = CMP-0548-00213-2: Transient Voltage Suppressor, 6.40 to 231 V, 36 V Stand-off Voltage, Bi-Directional, -55 to 155 degC, 2-pin DO-214AC, Pb-Free, Tape and Reel; Manufacturer: Vishay Semiconductor; IFSM: 40 A; VBR Bi-Directional (V): 6.4 to 231; PPPM (W): 400, 300; ID (uA): 2; VWM (V): 36; DatasheetVersion: 12/8/2013; ComponentLink2URL: http://www.vishay.com/docs/88390/smaj50a.pdf; Packing: Tape and Reel; PartNumber: SMAJ36CA-E3/61; ComponentLink3URL: http://www.vishay.com/docs/88390/smaj50a.pdf; Operating Junction and Storage Temperature Range: -55 to 150 degC; Mounting Technology: Surface Mount; ComponentLink1Description: Manufacturer URL; ComponentLink2Description: Datasheet; PackageReference: DO-214AC-2; ComponentLink3Description: Package Specification; RoHS: TRUE; ComponentLink1URL: http://www.vishay.com/; PackageDescription: 2-Pin DO-214AC (SMA), Body 4.245 x 2.665 mm
Q7 Q8 Q13 Q16 = DMN10H700S-7: MOSFET N-CHA 100V 700MA SOT23; Manufacturer: Diodes; Rds On Max: 700mR; Input Capacitance: 235pF; Max Power Dissipation: 400mW; Supplier 1: Digi-Key; Manufacturer Part Number: DMN10H700S-7; Stock 1: 12863; Pricing 1: 1=0.41000, 10=0.30800, 100=0.17450, 500=0.11556, 1000=0.08860 (USD); RoHS: Yes; Mount: Surface Mount; Case/Package: TO-236-3; Min Operating Temperature: -55°C; Max Operating Temperature: 150°C; Packaging: Tape and Reel; Drain to Source Voltage (Vdss): 100V; Continuous Drain Current (ID): 700mA; ComponentLink1URL: https://www.diodes.com/assets/Datasheets/DMN10H700S.pdf?src-supplier=Digi-Key; ComponentLink1Description: https://www.diodes.com/assets/Datasheets/DMN10H700S.pdf?src-supplier=Digi-Key; Supplier Part Number 1: DMN10H700S-7DICT-ND
Q9-Q12 Q14 Q15 Q17 Q18 = MMBTA06LT1G: TRANS NPN 80V 0.5A SOT23; Manufacturer: ON Semiconductor; Max Power Dissipation: 225mW; Number of Elements: 1; Frequency: 100MHz; Emitter Base Voltage (VEBO): 4V; Collector Emitter Saturation Voltage: 250mV; Max Collector Current: 500mA; Power Dissipation: 300mW; Element Configuration: Single; hFE Min: 100; Supplier 1: Digi-Key; Manufacturer Part Number: MMBTA06LT1G; Stock 1: 502614; Pricing 1: 1=0.19000, 10=0.17000, 100=0.09230, 500=0.05682, 1000=0.03874 (USD); RoHS: Yes; Case/Package: SOT-23-3; Number of Pins: 3; Contact Plating: Tin,Matte; Min Operating Temperature: -55°C; Max Operating Temperature: 150°C; Package Quantity: 1; Collector Emitter Voltage (VCEO): 80V; Packaging: Tape and Reel; Polarity: NPN; Collector Base Voltage (VCBO): 80V; Collector Emitter Breakdown Voltage: 80V; Transition Frequency: 100MHz; Max Breakdown Voltage: 80V; Max Frequency: 100MHz; Gain Bandwidth Product: 100MHz; Voltage Rating (DC): 80V; Current Rating: 500mA; Length: 0.119inch; Height: 0.04inch; Width: 0.055inch; Radiation Hardening: No; REACH SVHC: No SVHC; Lead Free: Lead Free; ComponentLink1URL: https://datasheet.ciiva.com/4722/mmbta05lt1-d-101659-4722113.pdf?src-supplier=Mouser; ComponentLink1Description: https://datasheet.ciiva.com/4722/mmbta05lt1-d-101659-4722113.pdf?src-supplier=Mouser; ComponentLink2URL: https://datasheet.ciiva.com/15139/getdatasheetpartid-137838-15139444.pdf?src-supplier=Verical; ComponentLink2Description: https://datasheet.ciiva.com/15139/getdatasheetpartid-137838-15139444.pdf?src-supplier=Verical; ComponentLink3URL: https://datasheet.ciiva.com/11197/mmbta05lt1-d-11197414.pdf?src-supplier=Avnet; ComponentLink3Description: https://datasheet.ciiva.com/11197/mmbta05lt1-d-11197414.pdf?src-supplier=Avnet; ComponentLink4URL: https://datasheet.ciiva.com/976/mmbta05lt1-d-976473.pdf?src-supplier=Digi-Key; ComponentLink4Description: https://datasheet.ciiva.com/976/mmbta05lt1-d-976473.pdf?src-supplier=Digi-Key; ComponentLink5URL: https://datasheet.ciiva.com/976/mmbta05lt1-d-976474.pdf?src-supplier=Digi-Key; ComponentLink5Description: https://datasheet.ciiva.com/976/mmbta05lt1-d-976474.pdf?src-supplier=Digi-Key; ComponentLink6URL: https://datasheet.ciiva.com/25998/mmbta05lt1-d-25998830.pdf?src-supplier=Avnet+Europe; ComponentLink6Description: https://datasheet.ciiva.com/25998/mmbta05lt1-d-25998830.pdf?src-supplier=Avnet+Europe; ComponentLink7URL: https://datasheet.ciiva.com/16465/mmbta05lt1-d-16465685.pdf?src-supplier=Future+Electronics; ComponentLink7Description: https://datasheet.ciiva.com/16465/mmbta05lt1-d-16465685.pdf?src-supplier=Future+Electronics; ComponentLink8URL: https://datasheet.ciiva.com/11198/mmbta05lt1-d-11198678.pdf?src-supplier=Avnet; ComponentLink8Description: https://datasheet.ciiva.com/11198/mmbta05lt1-d-11198678.pdf?src-supplier=Avnet; ComponentLink9URL: https://datasheet.ciiva.com/976/mmbta05lt1-d-976475.pdf?src-supplier=Digi-Key; ComponentLink9Description: https://datasheet.ciiva.com/976/mmbta05lt1-d-976475.pdf?src-supplier=Digi-Key; ComponentLink10URL: https://datasheet.ciiva.com/7972/mmbta05lt1-d-7972078.pdf?src-supplier=Element14; ComponentLink10Description: https://datasheet.ciiva.com/7972/mmbta05lt1-d-7972078.pdf?src-supplier=Element14; ComponentLink11URL: https://datasheet.ciiva.com/16478/mmbta05lt1-d-16478574.pdf?src-supplier=Avnet+Asia; ComponentLink11Description: https://datasheet.ciiva.com/16478/mmbta05lt1-d-16478574.pdf?src-supplier=Avnet+Asia; Supplier Part Number 1: MMBTA06LT1GOSCT-ND
R127 R128 R143 R157 = RMCF0402FT4K70: RES 4.7K OHM 1% 1/16W 0402; Manufacturer: Stackpole Electronics; Resistance: 4.7kR; Max Power Dissipation: 63mW; Temperature Coefficient: 100ppm/°C; Supplier 1: Digi-Key; Manufacturer Part Number: RMCF0402FT4K70; Stock 1: 817929; Pricing 1: 1=0.10000, 10=0.01500, 100=0.00610, 1000=0.00275, 2500=0.00239, 5000=0.00198 (USD); RoHS: Yes; Mount: Surface Mount; Case/Package: 0402; Case Code (Metric): 1005; Case Code (Imperial): 0402; Contact Plating: Tin,Matte; Min Operating Temperature: -55°C; Max Operating Temperature: 155°C; Packaging: Tape and Reel; Tolerance: 1%; Composition: Thick Film; Number of Terminations: 2; Military Standard: Not; Features: Automotive AEC-Q200; Length: 1mm; Height: 0.016inch; Width: 0.02inch; Depth: 0.5mm; Radiation Hardening: No; Lead Free: Lead Free; ComponentLink1URL: https://datasheet.ciiva.com/26936/getdatasheetpartid-743577-26936605.pdf?src-supplier=Verical; ComponentLink1Description: https://datasheet.ciiva.com/26936/getdatasheetpartid-743577-26936605.pdf?src-supplier=Verical; Supplier Part Number 1: RMCF0402FT4K70CT-ND
R129 R130 R133-R138 R144 R146 R147 R150 R158 R164-R166 = RMCF0603FT10K0: RES 10K OHM 1% 1/10W 0603; Manufacturer: Stackpole Electronics; Resistance: 10kR; Power Rating: 100mW; Temperature Coefficient: 100ppm/°C; Supplier 1: Digi-Key; Manufacturer Part Number: RMCF0603FT10K0; Stock 1: 2968232; Pricing 1: 1=0.10000, 10=0.01700, 100=0.00680, 1000=0.00306, 2500=0.00266 (USD); RoHS: Yes; Mount: Surface Mount; Case/Package: 0603; Case Code (Metric): 1608; Case Code (Imperial): 0603; Contact Plating: Tin,Matte; Min Operating Temperature: -55°C; Max Operating Temperature: 155°C; Tolerance: 1%; Packaging: Tape and Reel; Composition: Thick Film; Number of Terminations: 2; Military Standard: Not; Max Power Dissipation: 100mW; Features: Automotive AEC-Q200; Length: 1.55mm; Height: 0.022inch; Width: 0.031inch; Depth: 0.8mm; Radiation Hardening: No; Lead Free: Lead Free; ComponentLink1URL: http://components.arrow.com/part/dataview/43747082S6756917N1174?src-supplier=Arrow; ComponentLink1Description: http://components.arrow.com/part/dataview/43747082S6756917N1174?src-supplier=Arrow; ComponentLink2URL: https://www.seielect.com/catalog/sei-rmcf_rmcp.pdf?src-supplier=Digi-Key; ComponentLink2Description: https://www.seielect.com/catalog/sei-rmcf_rmcp.pdf?src-supplier=Digi-Key; ComponentLink3URL: https://www.seielect.com/catalog/SEI-RMCF_RMCP.pdf?src-supplier=Avnet; ComponentLink3Description: https://www.seielect.com/catalog/SEI-RMCF_RMCP.pdf?src-supplier=Avnet; ComponentLink4URL: http://www.seielect.com/catalog/sei-rmc.pdf?src-supplier=Future+Electronics; ComponentLink4Description: http://www.seielect.com/catalog/sei-rmc.pdf?src-supplier=Future+Electronics; ComponentLink5URL: https://www.verical.com/server-webapp/html/getDatasheet?partID=360913&src-supplier=Verical; ComponentLink5Description: https://www.verical.com/server-webapp/html/getDatasheet?partID=360913&src-supplier=Verical; Supplier Part Number 1: RMCF0603FT10K0CT-ND
R131 R132 R141 R142 R145 R153 R163 R168 = RMCF0402FT1K00: RES 1K OHM 1% 1/16W 0402; Manufacturer: Stackpole Electronics; Resistance: 1kR; Power Rating: 63mW; Temperature Coefficient: 100ppm/°C; Supplier 1: Digi-Key; Manufacturer Part Number: RMCF0402FT1K00; Stock 1: 1254280; Pricing 1: 1=0.10000, 10=0.01500, 100=0.00610, 1000=0.00275, 2500=0.00239, 5000=0.00198 (USD); RoHS: Yes; Mount: Surface Mount; Case/Package: 0402; Case Code (Metric): 1005; Case Code (Imperial): 0402; Contact Plating: Tin,Matte; Min Operating Temperature: -55°C; Max Operating Temperature: 155°C; Packaging: Tape and Reel; Tolerance: 1%; Composition: Thick Film; Number of Terminations: 2; Military Standard: Not; Max Power Dissipation: 63mW; Features: Automotive AEC-Q200; Length: 1mm; Height: 0.016inch; Width: 0.02inch; Depth: 0.5mm; Radiation Hardening: No; Lead Free: Lead Free; ComponentLink1URL: https://datasheet.ciiva.com/15193/getdatasheetpartid-365385-15193418.pdf?src-supplier=Verical; ComponentLink1Description: https://datasheet.ciiva.com/15193/getdatasheetpartid-365385-15193418.pdf?src-supplier=Verical; ComponentLink2URL: https://datasheet.ciiva.com/24336/sei-rmcp-24336266.pdf?src-supplier=Onlinecomponents.com; ComponentLink2Description: https://datasheet.ciiva.com/24336/sei-rmcp-24336266.pdf?src-supplier=Onlinecomponents.com; Supplier Part Number 1: RMCF0402FT1K00CT-ND; Supplier 2: Digi-Key; Supplier Part Number 2: 541-1.00KLCT-ND
R139 R140 R151 R167 = RNCP1206FTD1K00: RES 1K OHM 1% 1/2W 1206; Manufacturer: Stackpole Electronics; Resistance: 1kR; Max Power Dissipation: 500mW; Temperature Coefficient: 100ppm/°C; Supplier 1: Digi-Key; Manufacturer Part Number: RNCP1206FTD1K00; Stock 1: 275498; Pricing 1: 1=0.10000, 10=0.09300, 100=0.03580, 1000=0.01575, 2500=0.01360 (USD); RoHS: Yes; Mount: Surface Mount; Case/Package: 1206; Case Code (Metric): 3216; Case Code (Imperial): 1206; Contact Plating: Tin,Matte; Min Operating Temperature: -55°C; Max Operating Temperature: 155°C; Tolerance: 1%; Packaging: Tape and Reel; Composition: Thin Film; Number of Terminations: 2; Features: Moisture Resistant,Anti-Sulfur; Length: 0.122inch; Height: 0.024inch; Width: 0.059inch; Radiation Hardening: No; Lead Free: Lead Free; ComponentLink1URL: https://www.seielect.com/catalog/SEI-Packaging.pdf?src-supplier=Digi-Key; ComponentLink1Description: https://www.seielect.com/catalog/SEI-Packaging.pdf?src-supplier=Digi-Key; ComponentLink2URL: http://www.seielect.com/Catalog/SEI-rncp.pdf?src-supplier=Avnet; ComponentLink2Description: http://www.seielect.com/Catalog/SEI-rncp.pdf?src-supplier=Avnet; Supplier Part Number 1: RNCP1206FTD1K00CT-ND
R148 R149 R152 R154-R156 R159-R162 = CMP-1012-00586-1: 4K7 0.1W 1% 0603 (1608 Metric)  SMD; Case-EIA: 0603; Case-Metric: 1608; Value: 4700.00 Ohm; Power: 0.1 W; Tolerance: 1 %; Technology: SMT
U21 = 74LVC14APW-Q100J: IC SCHMITT TRIG HEX INV 14TSSOP; Manufacturer: NXP Semiconductors; Logic Function: Schmitt Trigger,Inverter; Low Level Output Current: 24mA; High Level Output Current: -24mA; Quiescent Current: 100nA; Propagation Delay: 14.7ns; Max Supply Voltage: 3.6V; Min Supply Voltage: 1.2V; Number of Elements: 6; Supplier 1: Digi-Key; Manufacturer Part Number: 74LVC14APW-Q100J; Stock 1: 4855; Pricing 1: 1=0.36000, 10=0.29400, 25=0.26880, 100=0.20010, 250=0.18132, 500=0.15004, 1000=0.11254 (USD); RoHS: Yes; Mount: Surface Mount; Case/Package: TSSOP; Number of Pins: 14; Min Operating Temperature: -40°C; Max Operating Temperature: 125°C; Packaging: Tape and Reel; Radiation Hardening: No; Lead Free: Lead Free; ComponentLink1URL: https://datasheet.ciiva.com/15012/74lvc14a-q100-15012081.pdf?src-supplier=Digi-Key; ComponentLink1Description: https://datasheet.ciiva.com/15012/74lvc14a-q100-15012081.pdf?src-supplier=Digi-Key; Supplier Part Number 1: 1727-8412-1-ND
U22 = CMP-1305-00036-1: Single Supply Quad Comparators, 0 to 70 degC, 14-Pin SOIC, Pb-Free, Tape and Reel; Manufacturer: On Semiconductor; IO Typ (mA): 16; ComponentLink3URL: http://www.onsemi.com/pub_link/Collateral/751A-03.PDF; RoHS: TRUE; Packing: Tape and Reel; ComponentLink2Description: Datasheet; ComponentLink2URL: http://www.onsemi.com/pub_link/Collateral/LM339-D.PDF; ComponentLink1Description: Manufacturer URL; PackageVersion: Rev. K, 05/2011; DatasheetVersion: Rev. 20; PackageReference: SOIC-14-751A-03; ComponentLink1URL: http://www.onsemi.com/; PartNumber: LM339DR2G; PackageDescription: 14-Pin Small Outline Integrated Circuit, Body 8.65 x 3.9 mm, Pitch 1.27 mm; ComponentLink3Description: Package Specification; Mounting Technology: Surface Mount